# Altium schematic sheet Amplifier-Speaker.SchDoc
size A; SheetNumber: 7; SheetTotal: 9
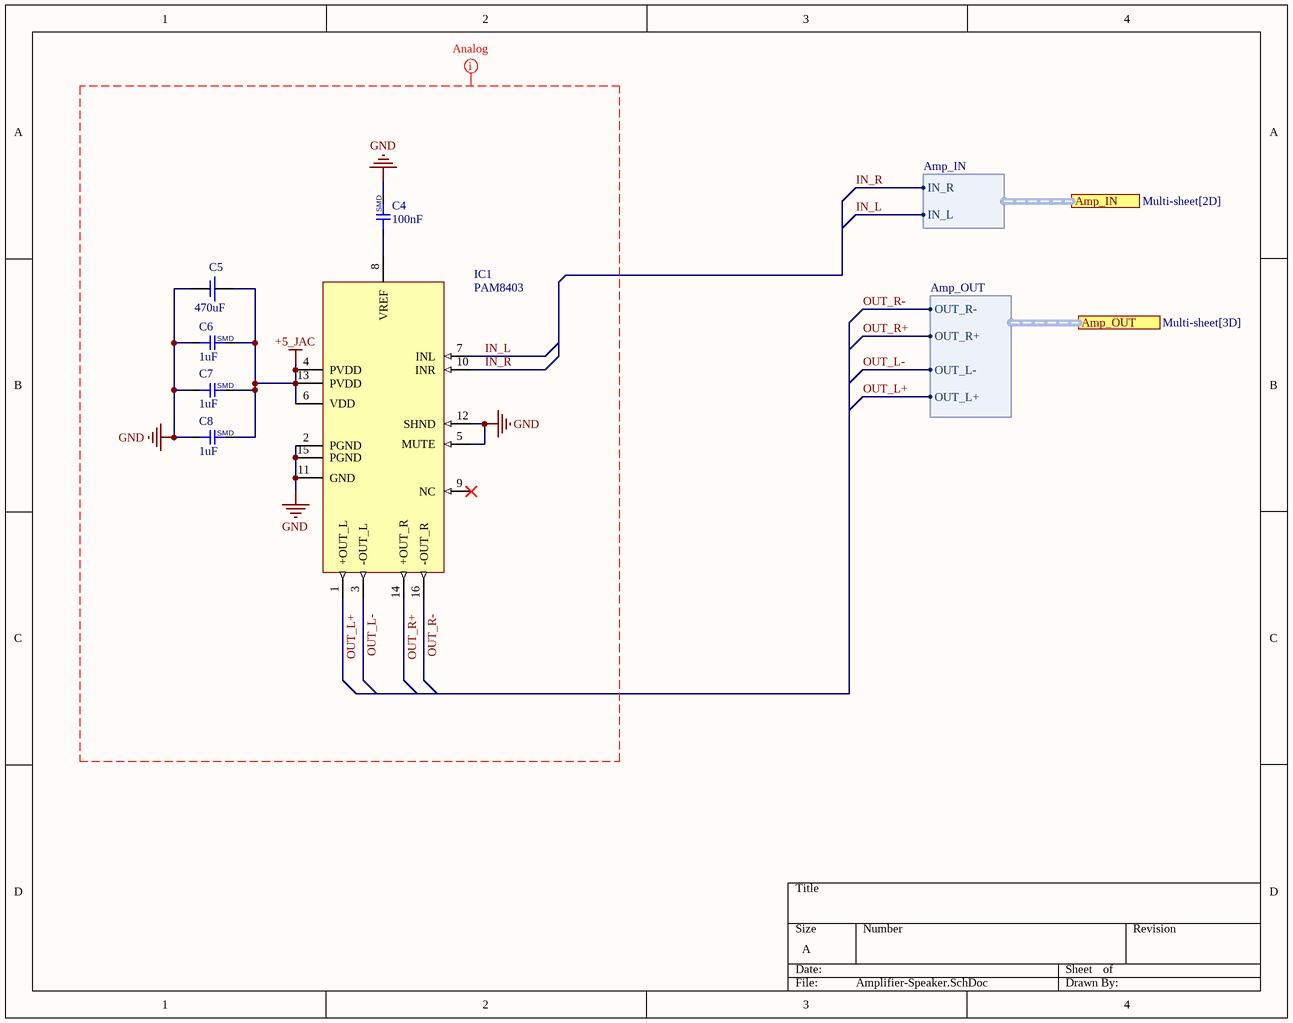
[diagram p0: Amplifier-Speaker.SchDoc]

## Parts
C4  100nF  [CAP-0603]
C5  470uF  [cap/330u/16v]
C6  1uF  [CAP-0805]
C7  1uF  [CAP-0805]
C8  1uF  [CAP-0805]
IC1  PAM8403  [SOP16]

## Ports
Amp_IN (harness Amp_IN, see Multi-sheet[2D]), Amp_OUT (harness Amp_OUT, see Multi-sheet[3D])

## Harnesses
Amp_IN: IN_R, IN_L
Amp_OUT: OUT_R-, OUT_R+, OUT_L-, OUT_L+

## Nets
+5_JAC: C5.+ C6.2 C7.2 C8.2 IC1.4(PVDD) IC1.6(VDD) IC1.13(PVDD)
GND: C4.2 C5.- C6.1 C7.1 C8.1 IC1.2(PGND) IC1.5(MUTE) IC1.11(GND) IC1.12(SHND) IC1.15(PGND)
IN_L: IC1.7(INL) ; port Amp_IN.IN_L
IN_R: IC1.10(INR) ; port Amp_IN.IN_R
OUT_L+: IC1.1(+OUT_L) ; port Amp_OUT.OUT_L+
OUT_L-: IC1.3(-OUT_L) ; port Amp_OUT.OUT_L-
OUT_R+: IC1.14(+OUT_R) ; port Amp_OUT.OUT_R+
OUT_R-: IC1.16(-OUT_R) ; port Amp_OUT.OUT_R-
NetC4_1: C4.1 IC1.8(VREF)

Not connected (* = marked no-connect by the designer): IC1 9(NC)*

## Layout directives
net class Analog: +5_JAC, GND, IN_L, IN_R, OUT_L+, OUT_L-, OUT_R+, OUT_R-

## Notes on the sheet
- (in symbol cap_smd) SMD

## Library data of the parts
C4 C6-C8 = cap_smd
C5 = cap-electrolit
IC1 = PAM8403: STEREO AUDIO AMPLIFIER